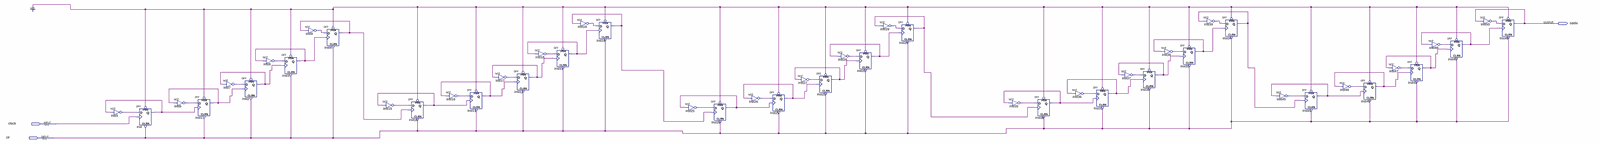
[diagram p0: schematic sheet, whole]
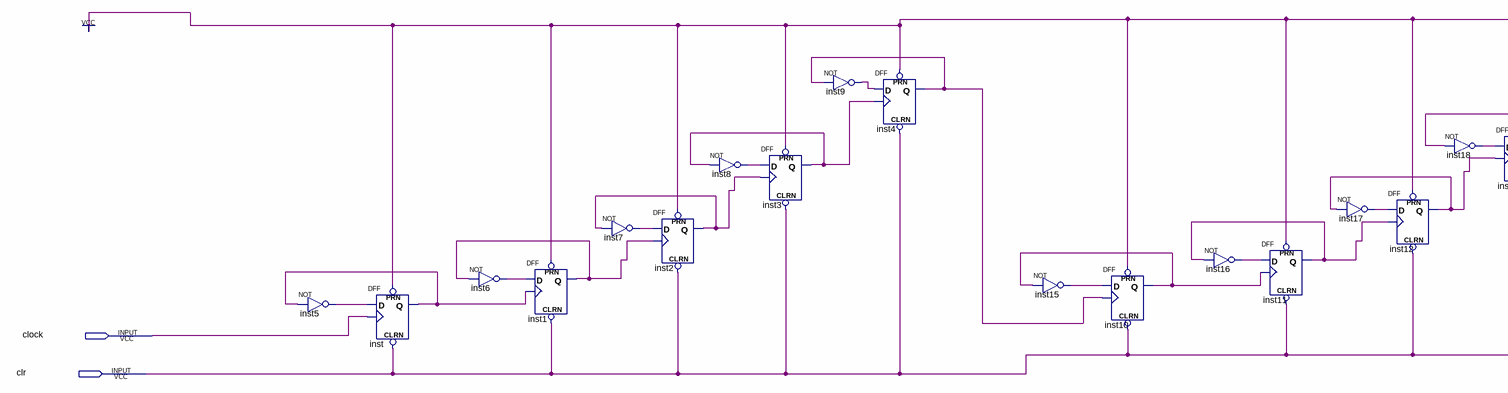
[diagram p1: schematic sheet, left part]
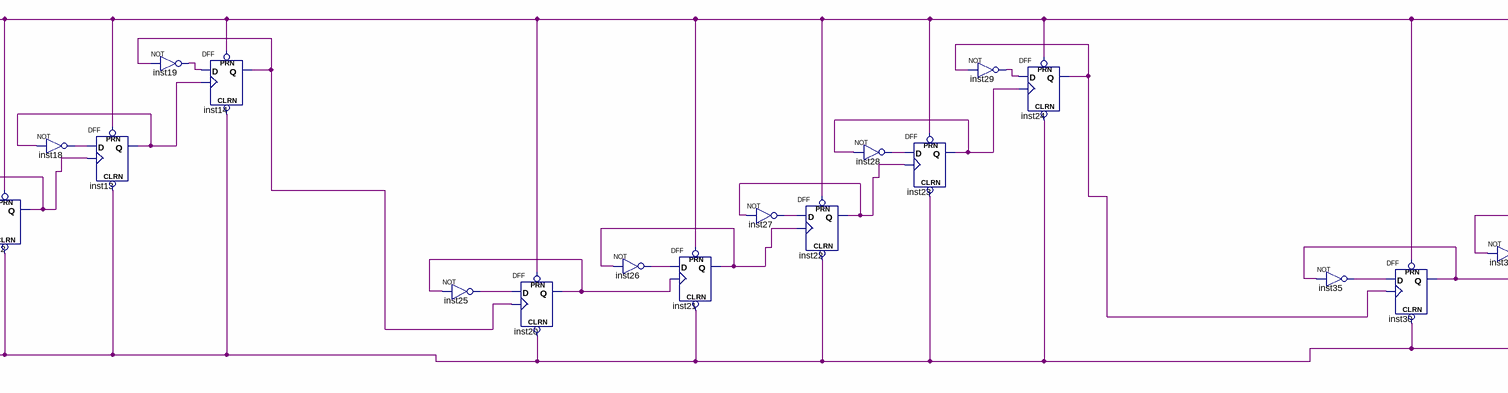
[diagram p2: schematic sheet, centre part]
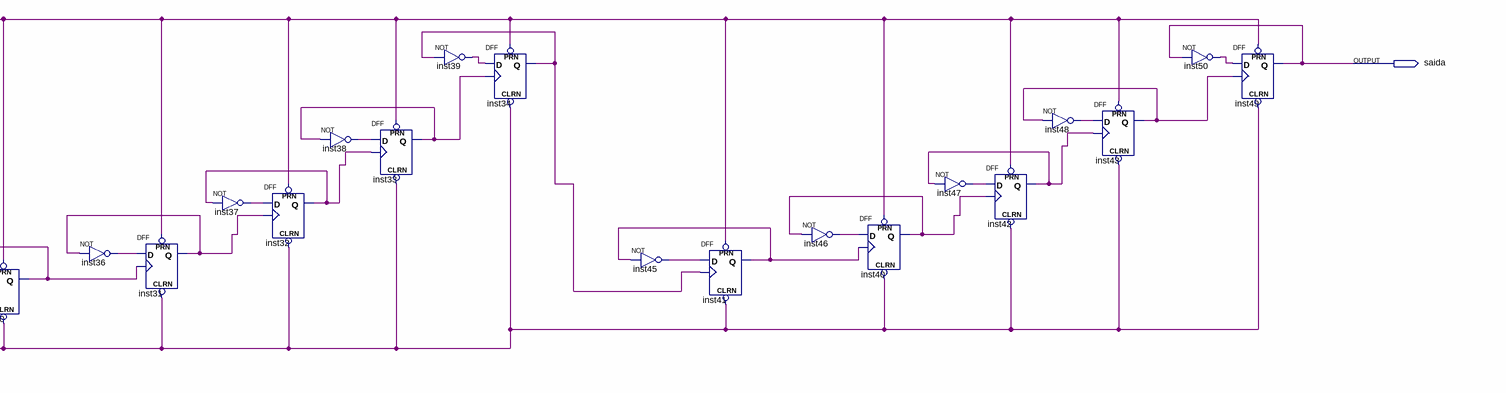
[diagram p3: schematic sheet, right part]
// Quartus schematic divisor_frequencia.bdf as structural Verilog: 50 symbols, 3 pins
module divisor_frequencia (
  input  clock,
  input  clr,
  output saida
);

  wire inst1_q, inst2_q, inst3_q, inst4_q, inst5_out, inst6_out, inst7_out, inst8_out, inst9_out, inst10_q,
       inst11_q, inst12_q, inst13_q, inst14_q, inst15_out, inst16_out, inst17_out, inst18_out, inst19_out,
       inst20_q, inst21_q, inst22_q, inst23_q, inst24_q, inst25_out, inst26_out, inst27_out, inst28_out,
       inst29_out, inst30_q, inst31_q, inst32_q, inst33_q, inst34_q, inst35_out, inst36_out, inst37_out,
       inst38_out, inst39_out, inst40_q, inst41_q, inst42_q, inst43_q, inst45_out, inst46_out, inst47_out,
       inst48_out, inst50_out, inst_q;

  not inst5 (inst5_out, inst_q);
  DFF inst (.CLRN(clr), .CLK(clock), .D(inst5_out), .PRN(1'b1), .Q(inst_q));
  not inst6 (inst6_out, inst1_q);
  DFF inst1 (.CLRN(clr), .CLK(inst_q), .D(inst6_out), .PRN(1'b1), .Q(inst1_q));
  not inst7 (inst7_out, inst2_q);
  DFF inst2 (.CLRN(clr), .CLK(inst1_q), .D(inst7_out), .PRN(1'b1), .Q(inst2_q));
  not inst8 (inst8_out, inst3_q);
  DFF inst3 (.CLRN(clr), .CLK(inst2_q), .D(inst8_out), .PRN(1'b1), .Q(inst3_q));
  not inst9 (inst9_out, inst4_q);
  DFF inst4 (.CLRN(clr), .CLK(inst3_q), .D(inst9_out), .PRN(1'b1), .Q(inst4_q));
  not inst15 (inst15_out, inst10_q);
  DFF inst10 (.CLRN(clr), .CLK(inst4_q), .D(inst15_out), .PRN(1'b1), .Q(inst10_q));
  not inst16 (inst16_out, inst11_q);
  DFF inst11 (.CLRN(clr), .CLK(inst10_q), .D(inst16_out), .PRN(1'b1), .Q(inst11_q));
  not inst17 (inst17_out, inst12_q);
  DFF inst12 (.CLRN(clr), .CLK(inst11_q), .D(inst17_out), .PRN(1'b1), .Q(inst12_q));
  not inst18 (inst18_out, inst13_q);
  DFF inst13 (.CLRN(clr), .CLK(inst12_q), .D(inst18_out), .PRN(1'b1), .Q(inst13_q));
  not inst19 (inst19_out, inst14_q);
  DFF inst14 (.CLRN(clr), .CLK(inst13_q), .D(inst19_out), .PRN(1'b1), .Q(inst14_q));
  not inst25 (inst25_out, inst20_q);
  DFF inst20 (.CLRN(clr), .CLK(inst14_q), .D(inst25_out), .PRN(1'b1), .Q(inst20_q));
  not inst26 (inst26_out, inst21_q);
  DFF inst21 (.CLRN(clr), .CLK(inst20_q), .D(inst26_out), .PRN(1'b1), .Q(inst21_q));
  not inst27 (inst27_out, inst22_q);
  DFF inst22 (.CLRN(clr), .CLK(inst21_q), .D(inst27_out), .PRN(1'b1), .Q(inst22_q));
  not inst28 (inst28_out, inst23_q);
  DFF inst23 (.CLRN(clr), .CLK(inst22_q), .D(inst28_out), .PRN(1'b1), .Q(inst23_q));
  not inst29 (inst29_out, inst24_q);
  DFF inst24 (.CLRN(clr), .CLK(inst23_q), .D(inst29_out), .PRN(1'b1), .Q(inst24_q));
  not inst35 (inst35_out, inst30_q);
  DFF inst30 (.CLRN(clr), .CLK(inst24_q), .D(inst35_out), .PRN(1'b1), .Q(inst30_q));
  not inst36 (inst36_out, inst31_q);
  DFF inst31 (.CLRN(clr), .CLK(inst30_q), .D(inst36_out), .PRN(1'b1), .Q(inst31_q));
  not inst37 (inst37_out, inst32_q);
  DFF inst32 (.CLRN(clr), .CLK(inst31_q), .D(inst37_out), .PRN(1'b1), .Q(inst32_q));
  not inst38 (inst38_out, inst33_q);
  DFF inst33 (.CLRN(clr), .CLK(inst32_q), .D(inst38_out), .PRN(1'b1), .Q(inst33_q));
  not inst39 (inst39_out, inst34_q);
  DFF inst34 (.CLRN(clr), .CLK(inst33_q), .D(inst39_out), .PRN(1'b1), .Q(inst34_q));
  not inst45 (inst45_out, inst41_q);
  DFF inst41 (.CLRN(clr), .CLK(inst34_q), .D(inst45_out), .PRN(1'b1), .Q(inst41_q));
  not inst46 (inst46_out, inst40_q);
  DFF inst40 (.CLRN(clr), .CLK(inst41_q), .D(inst46_out), .PRN(1'b1), .Q(inst40_q));
  not inst47 (inst47_out, inst42_q);
  DFF inst42 (.CLRN(clr), .CLK(inst40_q), .D(inst47_out), .PRN(1'b1), .Q(inst42_q));
  not inst48 (inst48_out, inst43_q);
  DFF inst43 (.CLRN(clr), .CLK(inst42_q), .D(inst48_out), .PRN(1'b1), .Q(inst43_q));
  not inst50 (inst50_out, saida);
  DFF inst49 (.CLRN(clr), .CLK(inst43_q), .D(inst50_out), .PRN(1'b1), .Q(saida));
endmodule
